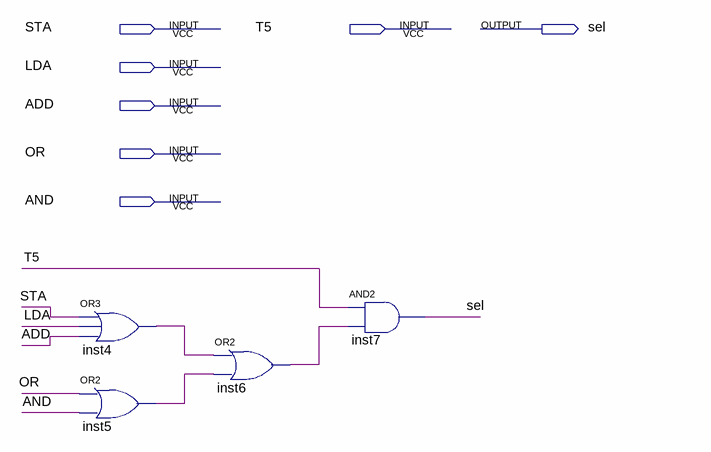
[diagram p0: schematic sheet]
// Quartus schematic sel.bdf as structural Verilog: 4 symbols, 7 pins
module sel (
  input  STA,
  input  T5,
  input  LDA,
  input  ADD,
  input  OR,
  input  AND,
  output sel
);

  wire inst4_out, inst5_out, inst6_out;

  or inst4 (inst4_out, STA, LDA, ADD);
  or inst5 (inst5_out, OR, AND);
  or inst6 (inst6_out, inst4_out, inst5_out);
  and inst7 (sel, T5, inst6_out);
endmodule
